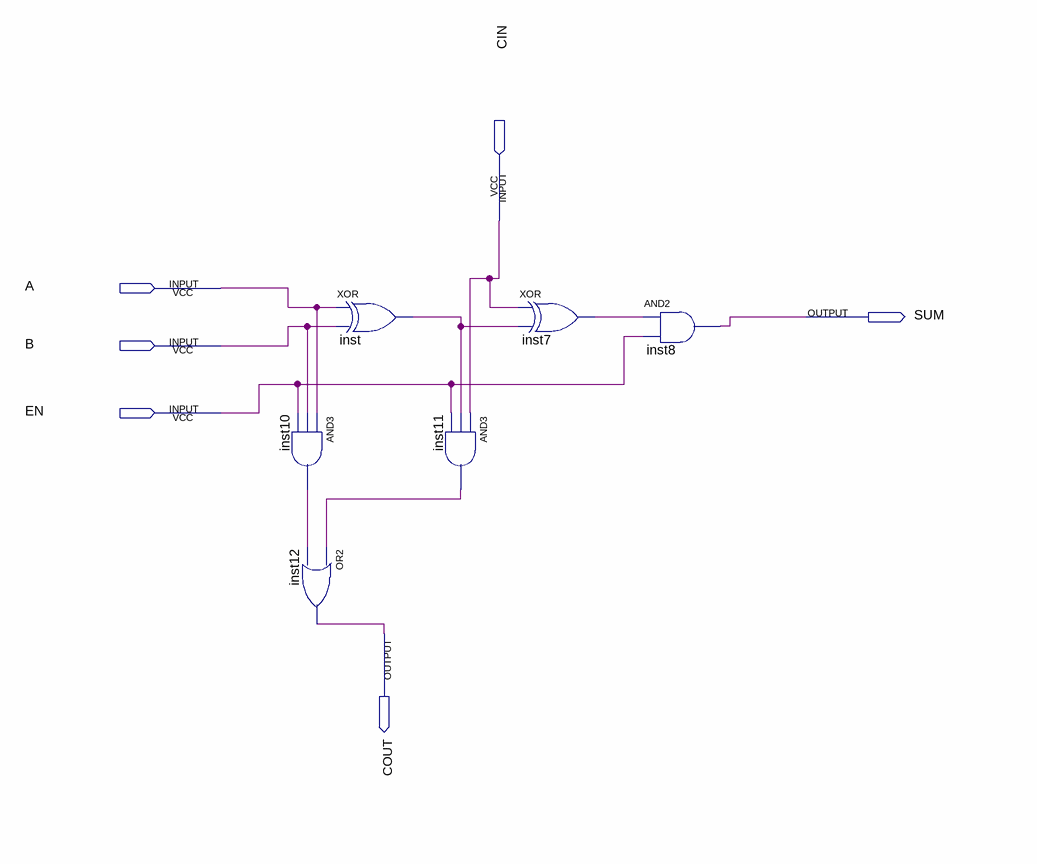
[diagram p0: schematic sheet]
// Quartus schematic FULL_ADDER_1bit.bdf as structural Verilog: 6 symbols, 6 pins
module FULL_ADDER_1bit (
  input  CIN,
  input  A,
  input  B,
  input  EN,
  output SUM,
  output COUT
);

  wire inst7_out, inst10_out, inst11_out, inst_out;

  and inst10 (inst10_out, A, B, EN);
  or inst12 (COUT, inst11_out, inst10_out);
  xor inst (inst_out, A, B);
  and inst11 (inst11_out, CIN, inst_out, EN);
  xor inst7 (inst7_out, CIN, inst_out);
  and inst8 (SUM, inst7_out, EN);
endmodule
